# Altium project Hydrophones_Front_Plane_1.PrjPcb
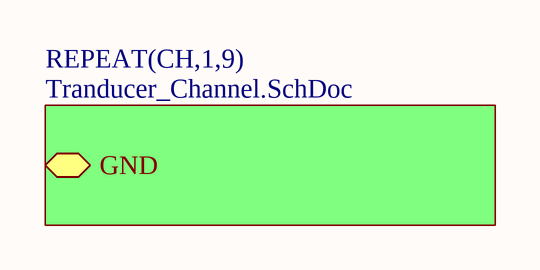
[diagram p0: Hydrophones_Front_Plane_1.SchDoc]
2 sheets, 45 parts. Net scope: hierarchical (ports join the sheet entries above them; power ports are global).
Board file: Hydrophones_Front_Plane_1.PcbDoc
Sheets:
  Hydrophones_Front_Plane_1.SchDoc
    CH1 = Tranducer_Channel.SchDoc
    CH2 = Tranducer_Channel.SchDoc
    CH3 = Tranducer_Channel.SchDoc
    CH4 = Tranducer_Channel.SchDoc
    CH5 = Tranducer_Channel.SchDoc
    CH6 = Tranducer_Channel.SchDoc
    CH7 = Tranducer_Channel.SchDoc
    CH8 = Tranducer_Channel.SchDoc
    CH9 = Tranducer_Channel.SchDoc

## Sheet Hydrophones_Front_Plane_1.SchDoc
size A

### Sub-sheets
REPEAT(CH,1,9) = Tranducer_Channel.SchDoc: GND

## Sheet Tranducer_Channel.SchDoc
size A
Used 9 times, as channels CH1, CH2, CH3, CH4, CH5, CH6, CH7, CH8, CH9. Parts and nets are listed once, with the designators drawn on the sheet.
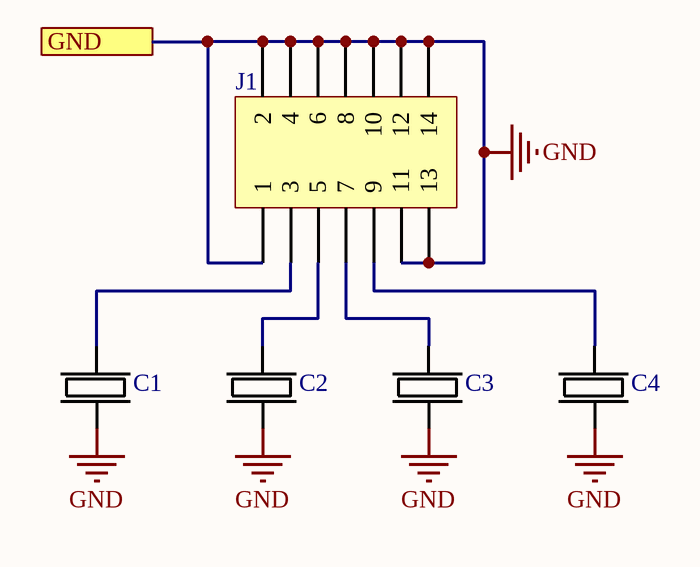
[diagram p1: Tranducer_Channel.SchDoc]

### Parts
C1  Transducer  [Transducer]  (value not drawn)
C2  Transducer  [Transducer]  (value not drawn)
C3  Transducer  [Transducer]  (value not drawn)
C4  Transducer  [Transducer]  (value not drawn)
J1  Header 7X2  [CONN_14x2_0.5IN]  (value not drawn)

### Ports
GND

### Nets
GND: C1.2 C2.2 C3.2 C4.2 J1.1 J1.2 J1.4 J1.6 J1.8 J1.10 J1.11 J1.12 J1.13 J1.14 ; port GND
NetC1_1: C1.1 J1.3
NetC2_1: C2.1 J1.5
NetC3_1: C3.1 J1.7
NetC4_1: C4.1 J1.9

### Channels
CH1: designators end in .A; ports GND=GND
CH2: designators end in .B; ports GND=GND
CH3: designators end in .C; ports GND=GND
CH4: designators end in .D; ports GND=GND
CH5: designators end in .E; ports GND=GND
CH6: designators end in .F; ports GND=GND
CH7: designators end in .G; ports GND=GND
CH8: designators end in .H; ports GND=GND
CH9: designators end in .I; ports GND=GND

### Library data of the parts
J1 = Header 7X2: Header, 7-Pin, Dual row; System: Connector; LatestRevisionDate: 17-Jul-2002; LatestRevisionNote: Re-released for DXP Platform.; Publisher: Altium Limited

## Nets that join several sheets
GND: CH1 (14 pins), CH2 (14 pins), CH3 (14 pins), CH4 (14 pins), CH5 (14 pins), CH6 (14 pins), CH7 (14 pins), CH8 (14 pins), CH9 (14 pins)